# Altium schematic sheet Connectors.SchDoc
size 146 x 107 mm; SheetNumber: 1; SheetTotal: 4
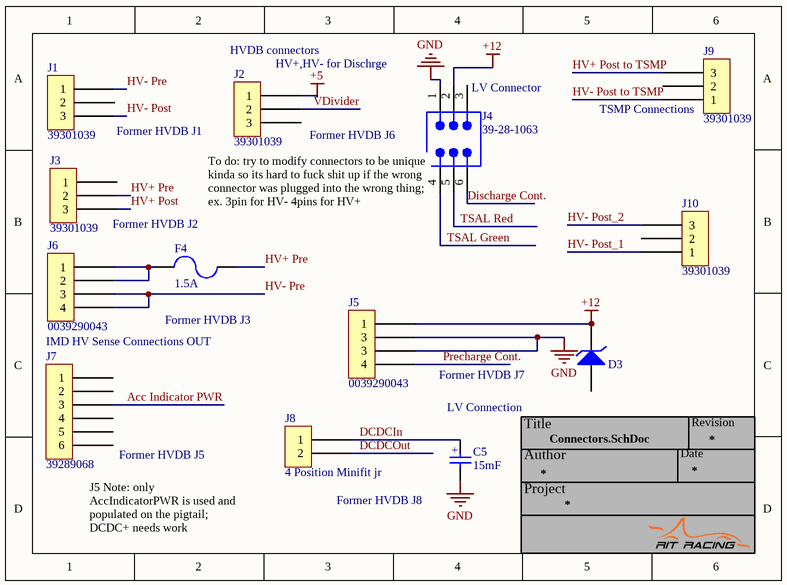
[diagram p0: Connectors.SchDoc]

## Parts
C5  15mF  [158KXM050M]
D3  (no value)  [DO-214AC]
F4  1.5A  [048501.5DR]
J1  39301039  [39301039]
J2  39301039  [39301039]
J3  39301039  [39301039]
J4  39-28-1063  [MOLX-39-28-1063_V]
J5  0039290043  [0039290043]
J6  0039290043  [0039290043]
J7  39289068  [39289068]
J8  4 Position Minifit jr  [0010845040]
J9  39301039  [39301039]
J10  39301039  [39301039]

## Nets
+5: J2.1
+12: D3.2(K) J4.2 J5.1
GND: C5.2(Neg) J4.1 J5.2(3) J5.3
Acc Indicator PWR: J7.3
DCDCIn: C5.1(Pos) J8.1
DCDCOut: J8.2
Discharge Cont.: J4.6
HV+ Post: J3.3
HV+ Post to TSMP: J9.3
HV+ Pre: F4.2 J3.2
HV- Post: J1.3
HV- Post to TSMP: J9.1
HV- Post_1: J10.1
HV- Post_2: J10.3
HV- Pre: J1.1 J6.3 J6.4
Precharge Cont.: J5.4
TSAL Green: J4.4
TSAL Red: J4.5
VDivider: J2.2
NetF4_1: F4.1 J6.1 J6.2

Not connected (* = marked no-connect by the designer): D3 1(A); J1 2; J2 3; J3 1; J4 3; J7 1 2 4 5 6; J9 2; J10 2

## Notes on the sheet
- (near J2) HVDB connectors
- (near J2) HV+,HV- for Dischrge
- Former HVDB J1
- (near J4) LV Connector
- (near J9) TSMP Connections
- Former HVDB J6
- Former HVDB J2
- (near J4) To do: try to modify connectors to be unique kinda so its hard to fuck shit up if the wrong connector was plugged into the wrong thing; ex. 3pin for HV- 4pins for HV+
- (near F4) Former HVDB J3
- IMD HV Sense Connections OUT
- Former HVDB J7
- (near J7) Former HVDB J5
- (near C5) LV Connection
- Former HVDB J8
- (near J7) J5 Note: only AccIndicatorPWR is used and populated on the pigtail; DCDC+ needs work
- Title
- Author
- Date
- Revision
- Project
- (in symbol 158KXM050M) +

## Library data of the parts
C5 = 158KXM050M: 1.5mF Electrolytic
D3 = SMAJ16A: TVS Diode, SMD Mount, 16V Withstand, 17.8V Breakdown, 400W; TargetLibrary: RITRacing-Passives; MFG: Littlefuse; Publisher: T.Tallo; Published: 22Oct2016; Status: Active; PartNumber: SMAJ16A
F4 = 048501.5DR: 1.5A 600VDC Fuse, SMD Mount; Manufactuer: Littlefuse; TargetLibrary: RITRacing-Passives; Value: Value?; Publisher: T.Tallo; Published: 22Oct2016; Status: Active; Datasheet: https://www.littelfuse.com/~/media/electronics/datasheets/fuses/littelfuse_fuse_485_datasheet.pdf.pdf; Part Number: 048501.5DR
J1-J3 J9 J10 = 39301039: 3 Pin Minifit vertical
  J9: Supplier 1: Digi-Key; Supplier Part Number 1: WM18442-ND
J4 = CMP-1594-00001-1: 4.2 mm Pitch Mini-Fit Jr.Power Connector, Vertical, Through Hole, 6 Circuits, -40 to 105 degC, RoHS, Bag; Pitch: 4.2 mm; No. of Positions: 6; No. of Rows: 2; PartNumber: 39-28-1063; ComponentLink3Description: Package Specification; ComponentLink1URL: http://www.molex.com/; PackageVersion: Rev. F, 06/2009; Orientation: Vertical; ComponentLink3URL: http://www.molex.com/pdm_docs/sd/039281063_sd.pdf; ComponentLink2Description: Datasheet; PackageDescription: 6-Pin PCB Header, Vertical, Pitch 4.2 mm, Through Hole; ComponentLink1Description: Manufacturer URL; Temperature Min: -40 degC; RoHS: TRUE; Packing: Bag; Mounting Technology: Through Hole; Temperature Max: 105 degC; ComponentLink2URL: http://www.molex.com/webdocs/datasheets/pdf/en-us/0039281063_PCB_HEADERS.pdf
J5 J6 = 0039290043: Minifit jr 4 position
J8 = 0010845040